# EasyEDA schematic ESP_SCH.json
TITLE: DRONE_ESP_SHIELD; REV: 3.0; Date: 17-11-2023; Sheet: 1/1; Company: QUB
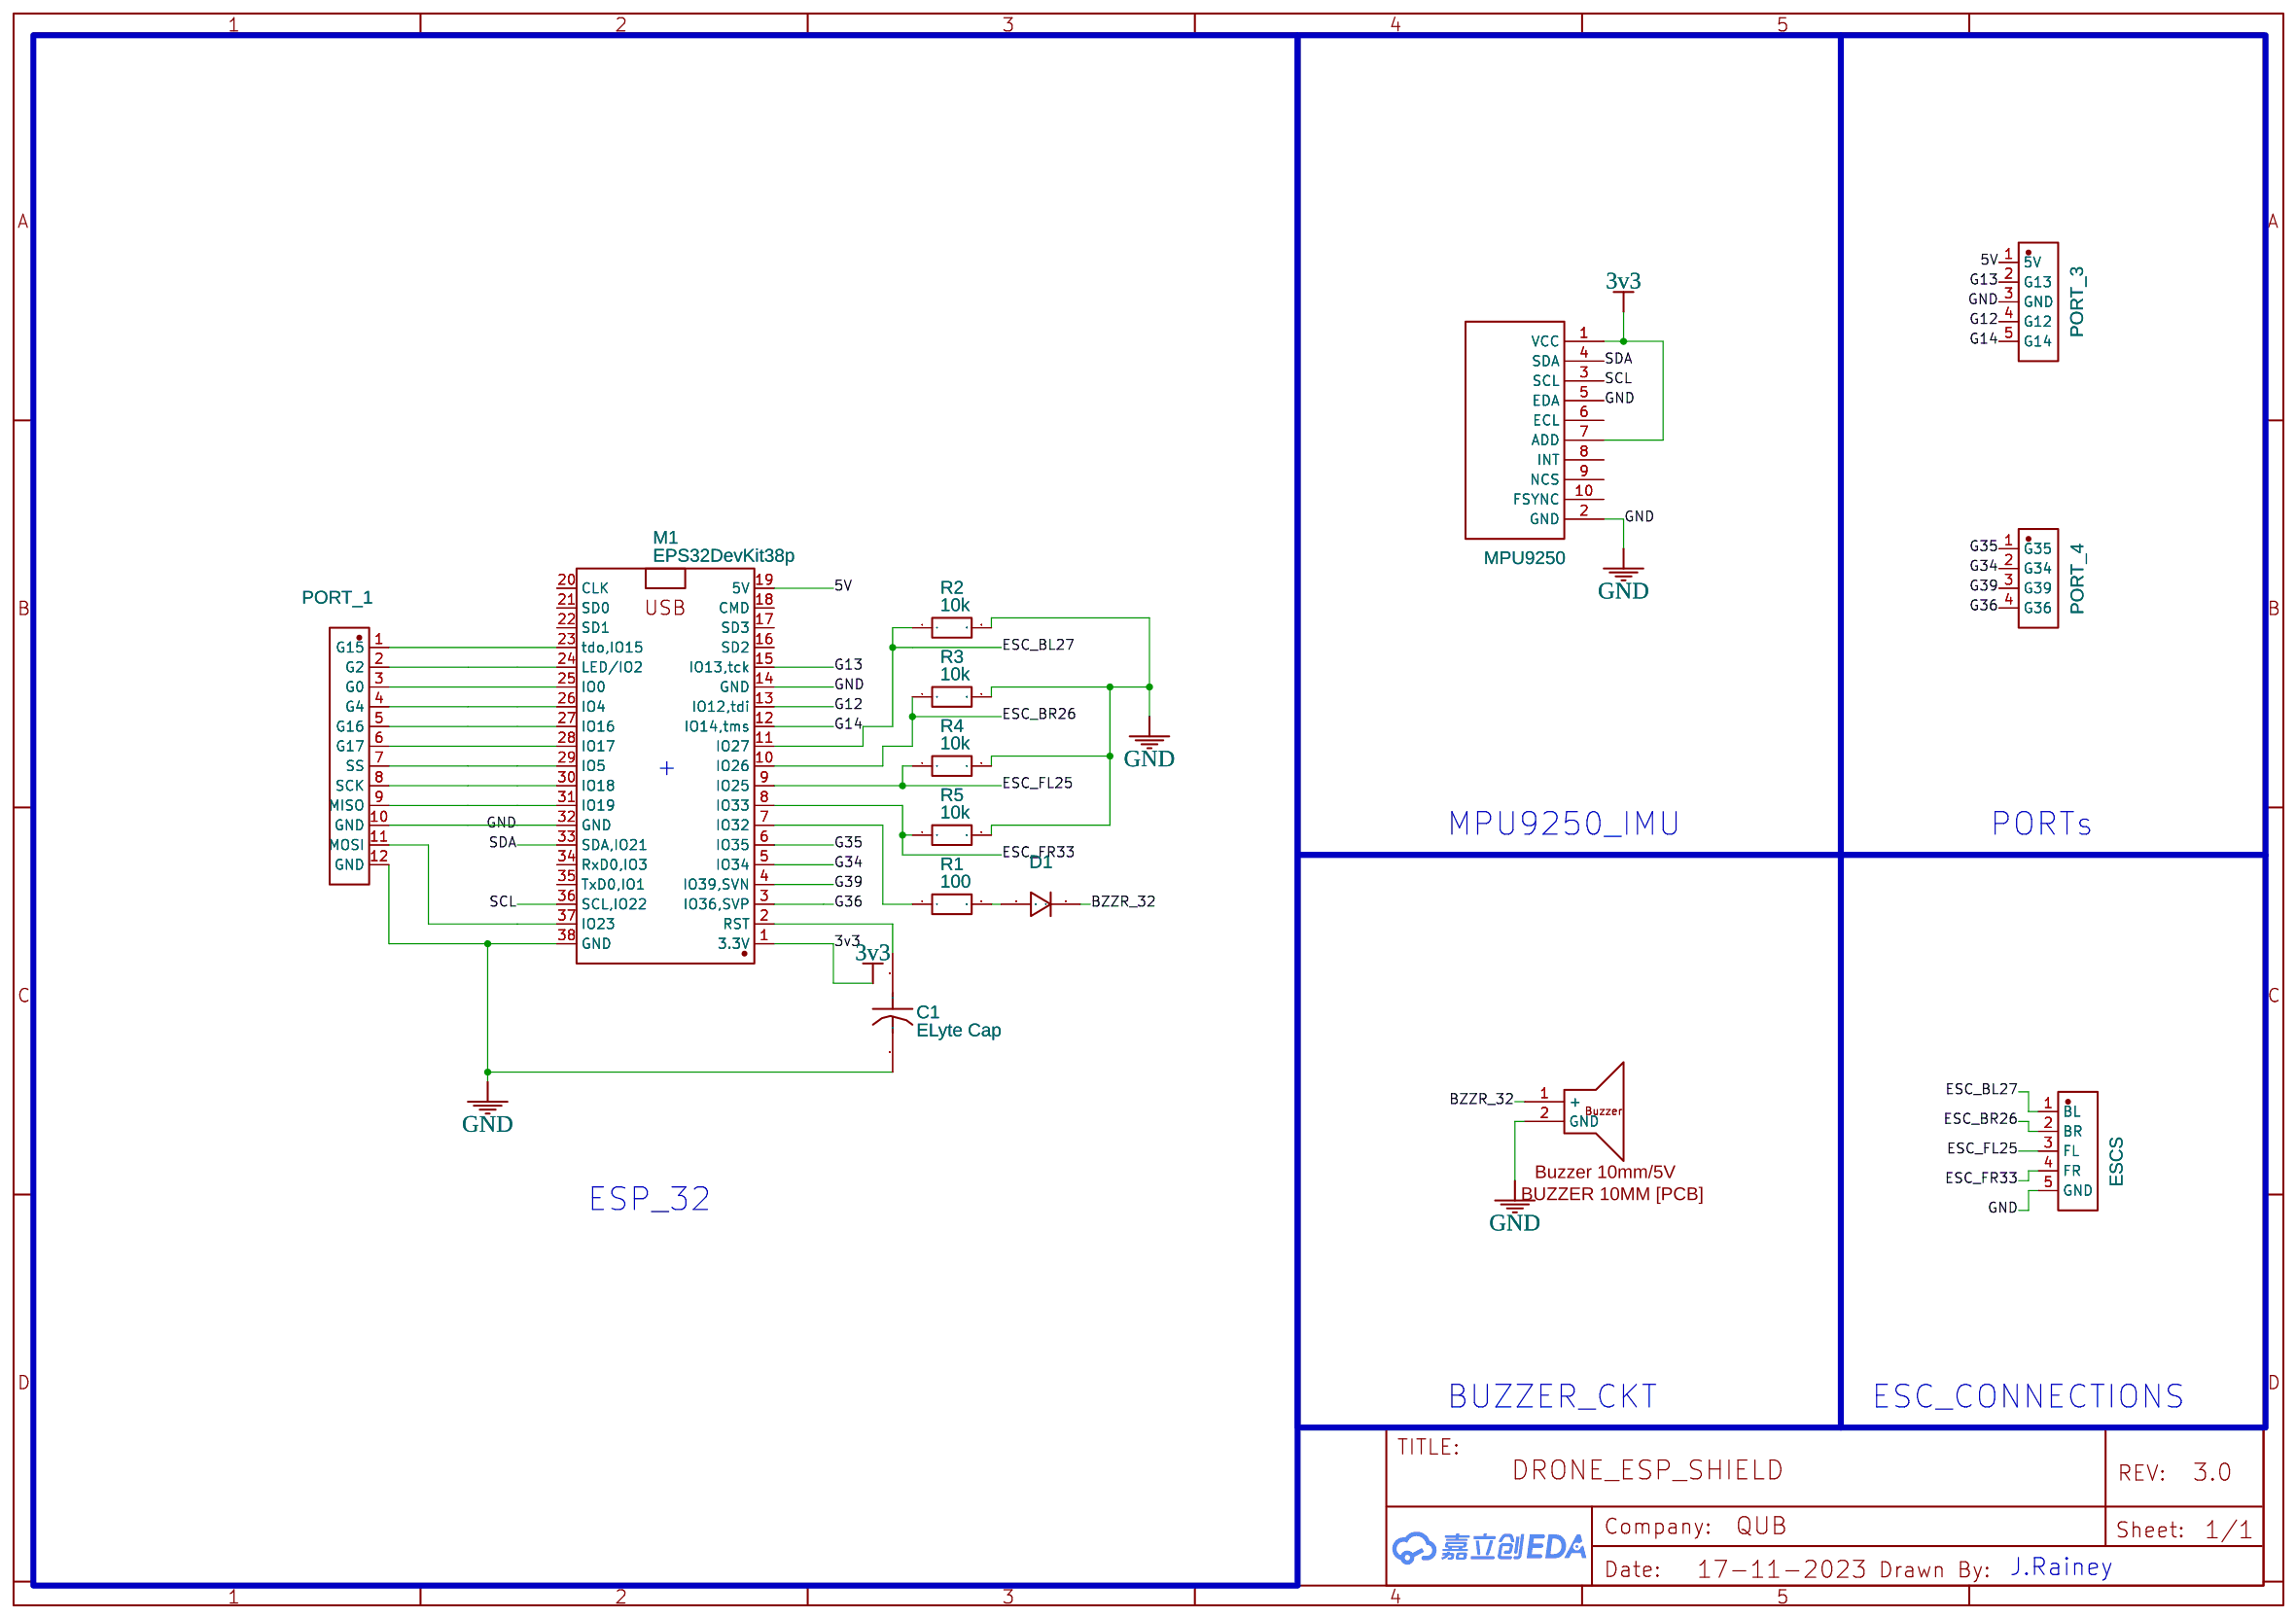
[diagram p0: schematic sheet]

## Parts
BUZZER  Buzzer 10mm/5V  [BUZZER 10MM [PCB]]
C1  ELyte Cap  [ELECTROLITIC CAPACITOR]
D1  1N4448  [DO-35_BD2.0-L4.2-P8.20-D0.5-R-RD]
ESCS  PORT_3  [HDR-TH_5P-P2.54-V-M]
M1  EPS32DevKit38p  [ESP32DEVKIT38-UNB]
MPU9250  MPU9250  [MPU9250 MODULE]
PORT_1  ZX-PM2.54-1-12PY  [HDR-TH_12P-P2.54-V-F]
PORT_3  PORT_3  [HDR-TH_5P-P2.54-V-M]
PORT_4  0022285044  [HDR-TH_4P-P2.54-V-M-1]
R1  100  [R_AXIAL-0.4]
R2  10k  [R_AXIAL-0.4]
R3  10k  [R_AXIAL-0.4]
R4  10k  [R_AXIAL-0.4]
R5  10k  [R_AXIAL-0.4]

## Library data of the parts
BUZZER = Buzzer 10mm/5V: Supplier: SHIVRAM; Manufacturer: SHIVRAM; Contributor: Scikraft; Package Display: Yes
C1 = Electrolitic Capacitor: Contributor: dbrancam
D1 = 1N4448: Contributor: 官方封装库; Supplier: LCSC; Manufacturer: ST(先科); Supplier Part: C54037; JLCPCB Part Class: Extended Part
ESCS PORT_3 = DS1002-03-1X5131: Supplier: LCSC; Supplier Part: C7495240; Manufacturer: CONNFLY; Contributor: lcsc
M1 = EPS32DevKit38p: Contributor: unbrainen
MPU9250 = MPU9250 MODULE: Contributor: gnatyuk.yevg; Package Display: No
PORT_1 = ZX-PM2.54-1-12PY: Supplier: LCSC; Supplier Part: C7499331; Manufacturer: Megastar(兆星); Contributor: lcsc
PORT_4 = 0022285044: Supplier: LCSC; Supplier Part: C9900016049; Manufacturer: null; JLCPCB Part Class: Extended Part; Contributor: lcsc
R1-R5 = R_AXIAL-0.4_EU: Contributor: LCEDA_Lib

## Nets
3v3: M1.1(3.3V) MPU9250.1(VCC) MPU9250.7(ADD)
5V: M1.19(5V) PORT_3.1(5V)
GND: BUZZER.2(GND) C1.2 ESCS.5(GND) M1.14(GND) M1.32(GND) M1.38(GND) MPU9250.2(GND) MPU9250.5(EDA) PORT_1.10(GND) PORT_1.12(GND) PORT_3.3(GND) R2.2 R3.2 R4.2 R5.2
BZZR_32: BUZZER.1(+) D1.2(K)
ESC_BL27: ESCS.1(BL) M1.11(IO27) R2.1
ESC_BR26: ESCS.2(BR) M1.10(IO26) R3.1
ESC_FL25: ESCS.3(FL) M1.9(IO25) R4.1
ESC_FR33: ESCS.4(FR) M1.8(IO33) R5.1
G12: M1.13(IO12,tdi) PORT_3.4(G12)
G13: M1.15(IO13,tck) PORT_3.2(G13)
G14: M1.12(IO14,tms) PORT_3.5(G14)
G34: M1.5(IO34) PORT_4.2(G34)
G35: M1.6(IO35) PORT_4.1(G35)
G36: M1.3(IO36,SVP) PORT_4.4(G36)
G39: M1.4(IO39,SVN) PORT_4.3(G39)
SCL: M1.36(SCL,IO22) MPU9250.3(SCL)
SDA: M1.33(SDA,IO21) MPU9250.4(SDA)
Net-(C1-1): C1.1 M1.2(RST)
Net-(D1-1): D1.1(A) R1.2
Net-(M1-7): M1.7(IO32) R1.1
Net-(M1-23): M1.23(tdo,IO15) PORT_1.1(G15)
Net-(M1-24): M1.24(LED/IO2) PORT_1.2(G2)
Net-(M1-25): M1.25(IO0) PORT_1.3(G0)
Net-(M1-26): M1.26(IO4) PORT_1.4(G4)
Net-(M1-27): M1.27(IO16) PORT_1.5(G16)
Net-(M1-28): M1.28(IO17) PORT_1.6(G17)
Net-(M1-29): M1.29(IO5) PORT_1.7(SS)
Net-(M1-30): M1.30(IO18) PORT_1.8(SCK)
Net-(M1-31): M1.31(IO19) PORT_1.9(MISO)
Net-(M1-37): M1.37(IO23) PORT_1.11(MOSI)

Not connected (* = marked no-connect by the designer): M1 16(SD2) 17(SD3) 18(CMD) 20(CLK) 21(SD0) 22(SD1) 34(RxD0,IO3) 35(TxD0,IO1); MPU9250 6(ECL) 8(INT) 9(NCS) 10(FSYNC)

## Notes on the sheet
- +
- MPU9250_IMU
- PORTs
- ESP_32
- BUZZER_CKT
- ESC_CONNECTIONS
- J.Rainey
